# Altium schematic sheet Ring 4_C.SchDoc
size A; DocumentNumber: 12; SheetNumber: 20; SheetTotal: 30
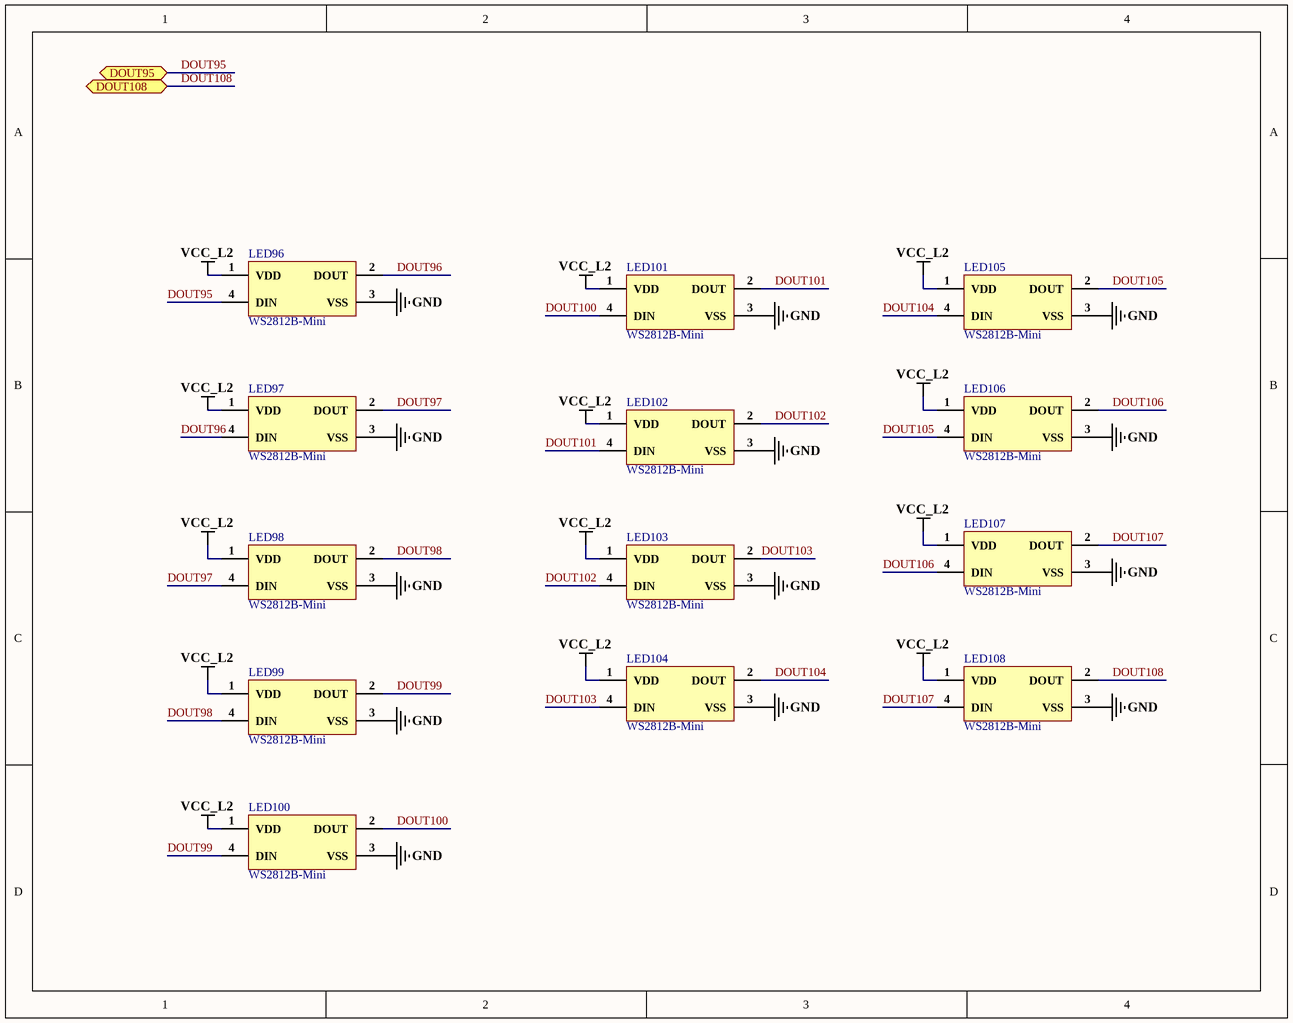
[diagram p0: Ring 4_C.SchDoc]

## Parts
LED96  WS2812B-Mini  [WS2812B-Mini]
LED97  WS2812B-Mini  [WS2812B-Mini]
LED98  WS2812B-Mini  [WS2812B-Mini]
LED99  WS2812B-Mini  [WS2812B-Mini]
LED100  WS2812B-Mini  [WS2812B-Mini]
LED101  WS2812B-Mini  [WS2812B-Mini]
LED102  WS2812B-Mini  [WS2812B-Mini]
LED103  WS2812B-Mini  [WS2812B-Mini]
LED104  WS2812B-Mini  [WS2812B-Mini]
LED105  WS2812B-Mini  [WS2812B-Mini]
LED106  WS2812B-Mini  [WS2812B-Mini]
LED107  WS2812B-Mini  [WS2812B-Mini]
LED108  WS2812B-Mini  [WS2812B-Mini]

## Ports
DOUT95 (bidir), DOUT108 (bidir)

## Nets
GND: LED96.3(VSS) LED97.3(VSS) LED98.3(VSS) LED99.3(VSS) LED100.3(VSS) LED101.3(VSS) LED102.3(VSS) LED103.3(VSS) LED104.3(VSS) LED105.3(VSS) LED106.3(VSS) LED107.3(VSS) LED108.3(VSS)
VCC_L2: LED96.1(VDD) LED97.1(VDD) LED98.1(VDD) LED99.1(VDD) LED100.1(VDD) LED101.1(VDD) LED102.1(VDD) LED103.1(VDD) LED104.1(VDD) LED105.1(VDD) LED106.1(VDD) LED107.1(VDD) LED108.1(VDD)
DOUT95: LED96.4(DIN) ; port DOUT95
DOUT96: LED96.2(DOUT) LED97.4(DIN)
DOUT97: LED97.2(DOUT) LED98.4(DIN)
DOUT98: LED98.2(DOUT) LED99.4(DIN)
DOUT99: LED99.2(DOUT) LED100.4(DIN)
DOUT100: LED100.2(DOUT) LED101.4(DIN)
DOUT101: LED101.2(DOUT) LED102.4(DIN)
DOUT102: LED102.2(DOUT) LED103.4(DIN)
DOUT103: LED103.2(DOUT) LED104.4(DIN)
DOUT104: LED104.2(DOUT) LED105.4(DIN)
DOUT105: LED105.2(DOUT) LED106.4(DIN)
DOUT106: LED106.2(DOUT) LED107.4(DIN)
DOUT107: LED107.2(DOUT) LED108.4(DIN)
DOUT108: LED108.2(DOUT) ; port DOUT108

## Library data of the parts
LED96-LED108 = WS2812B-Mini: SMD,3.5x3.5mm Light Emitting Diodes (LED) RoHS; Manufacturer: Worldsemi; ComponentLink1Description: LCSC; ComponentLink1URL: *https://lcsc.com/product-detail/Light-Emitting-Diodes-LED_Worldsemi-WS2812B-Mini_C527089.html; Package: SMD,3.5x3.5mm; Parameter 1: *